# EAGLE design opnic (EAGLE 9.6.2)
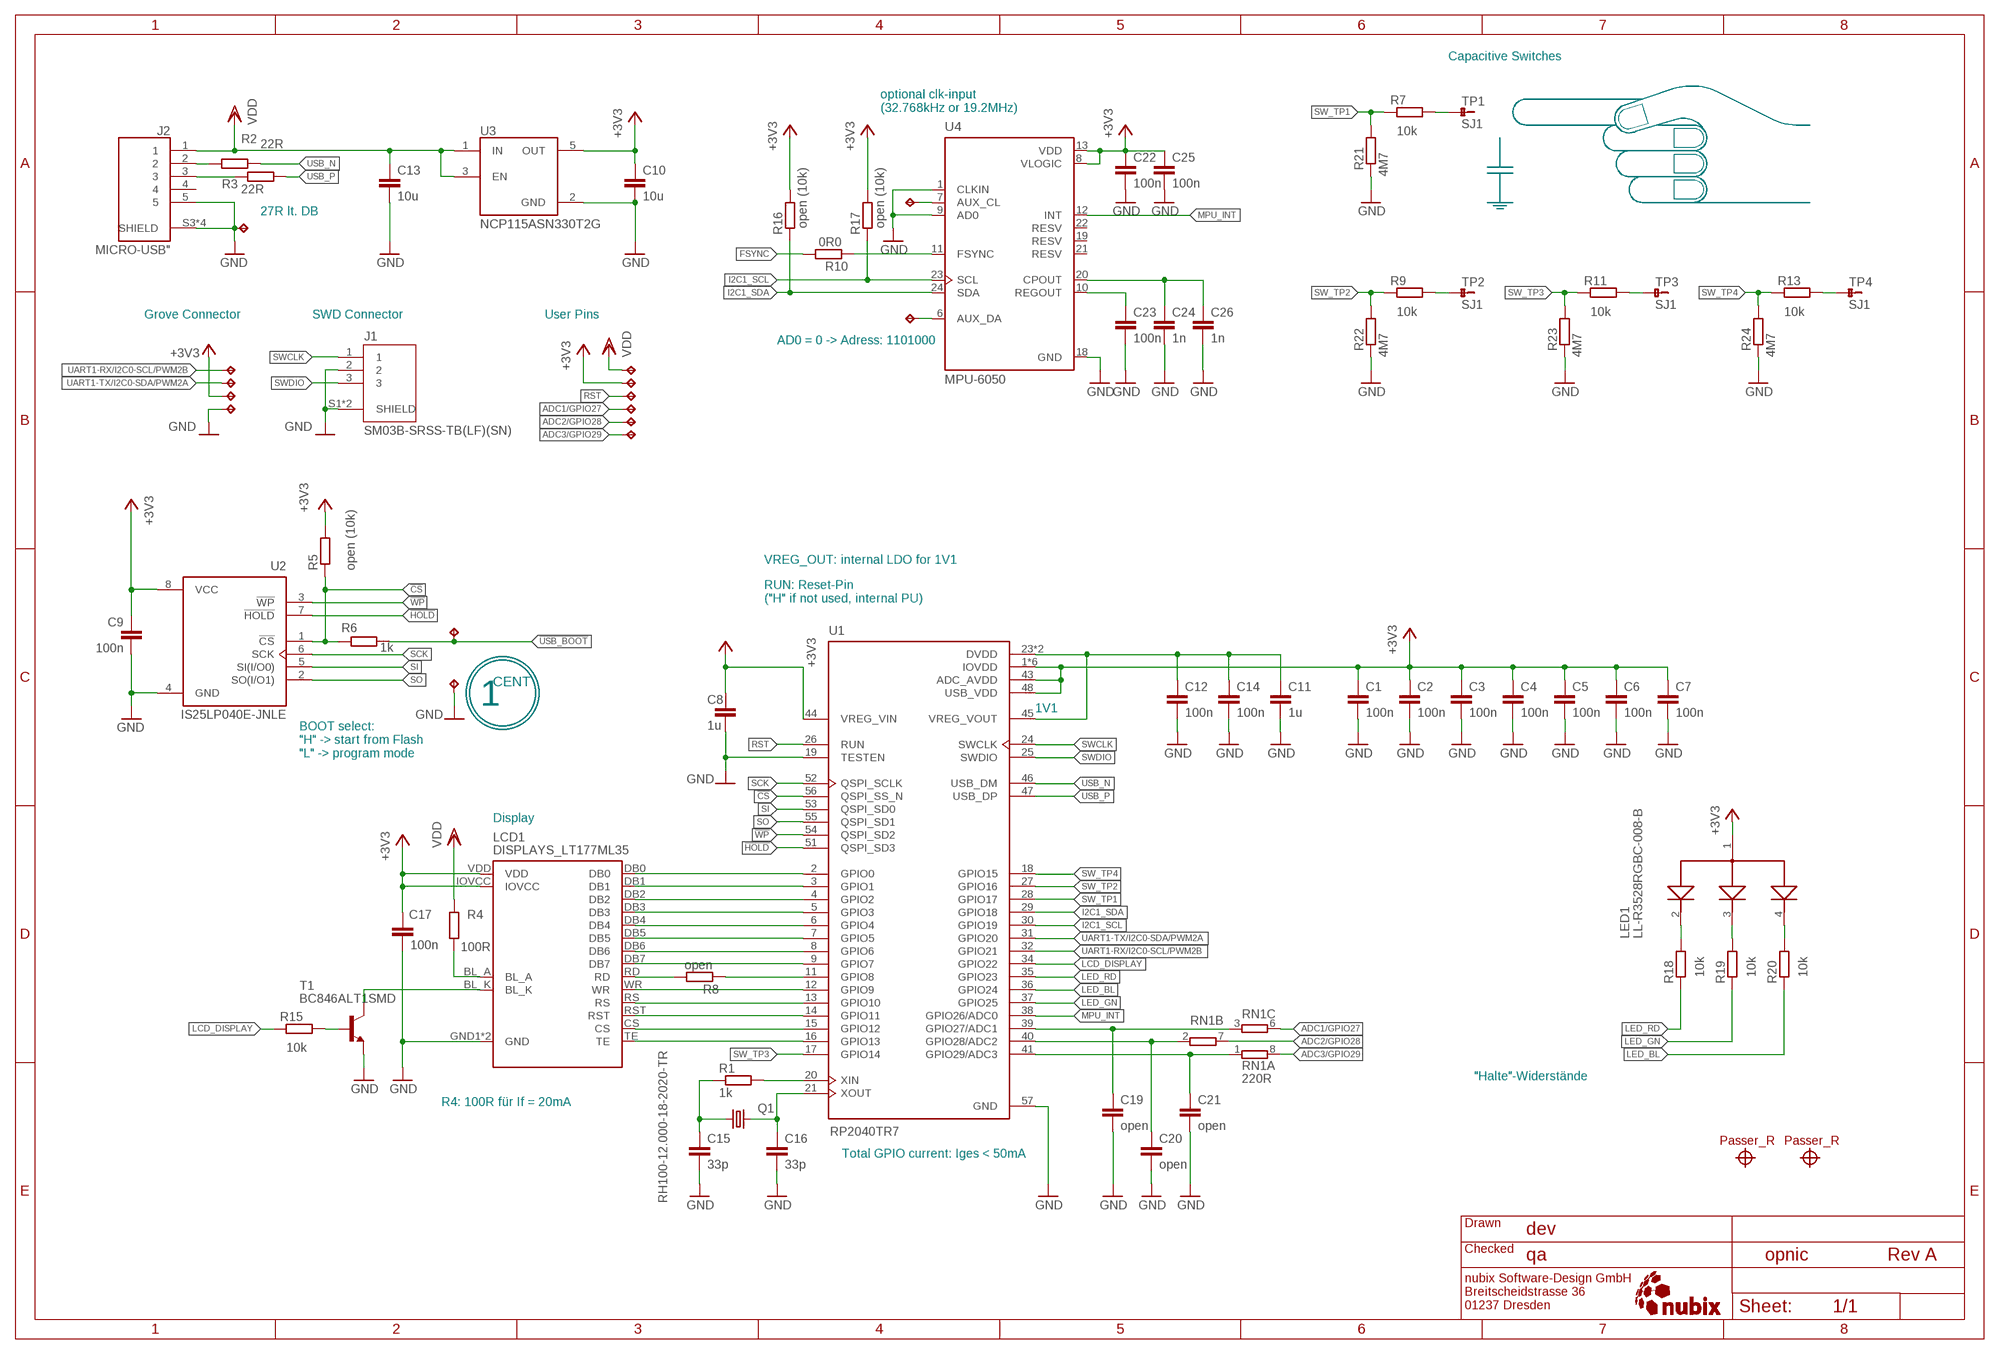
[diagram p0: schematic, sheet 1]
FRAME1 (A3L-LOC): NAME_CHECK: qa; NAME_DRAW: dev

## Parts
3V3  TPTP06SQ  [TP06SQ]
C1  100n  C-EUC0603  [C0603]
C2  100n  C-EUC0603  [C0603]
C3  100n  C-EUC0603  [C0603]
C4  100n  C-EUC0603  [C0603]
C5  100n  C-EUC0603  [C0603]
C6  100n  C-EUC0603  [C0603]
C7  100n  C-EUC0603  [C0603]
C8  1u  C-EUC0805  [C0805]
C9  100n  C-EUC0603  [C0603]
C10  10u  C-EUC1206  [C1206]
C11  1u  C-EUC0805  [C0805]
C12  100n  C-EUC0603  [C0603]
C13  10u  C-EUC1206  [C1206]
C14  100n  C-EUC0603  [C0603]
C15  33p  C-EUC0603  [C0603]
C16  33p  C-EUC0603  [C0603]
C17  100n  C-EUC0603  [C0603]
C19  open  C-EUC0603  [C0603]
C20  open  C-EUC0603  [C0603]
C21  open  C-EUC0603  [C0603]
C22  100n  C-EUC0603  [C0603]
C23  100n  C-EUC0603  [C0603]
C24  1n  C-EUC0603  [C0603]
C25  100n  C-EUC0603  [C0603]
C26  1n  C-EUC0603  [C0603]
CL  TPTP15SQ  [TP15SQ]
DA  TPTP15SQ  [TP15SQ]
GND  TPTP06SQ  [TP06SQ]
J1  SM03B-SRSS-TB(LF)(SN)  [JST_SM03B-SRSS-TB(LF)(SN)]
J2  MICRO-USB"  [MICRO-USB_MIDMOUNT]
LCD1  DISPLAYS_LT177ML35  [DISPLAYS_LT177ML35]
LED1  LL-R3528RGBC-008-B  [LED_LL-R3528RGBC-008-B]
P27  TPTP06SQ  [TP06SQ]
P28  TPTP06SQ  [TP06SQ]
P29  TPTP06SQ  [TP06SQ]
Q1  RH100-12.000-18-2020-TR  KX-7  [3.2X2.5_KX-7]
R1  1k  R-EU_R0603  [R0603]
R2  22R  R-EU_R0603  [R0603]
R3  22R  R-EU_R0603  [R0603]
R4  100R  R-EU_R0603  [R0603]
R5  open (10k)  R-EU_R0603  [R0603]
R6  1k  R-EU_R0603  [R0603]
R7  10k  R-EU_R0603  [R0603]
R8  open  R-EU_R0603  [R0603]
R9  10k  R-EU_R0603  [R0603]
R10  0R0  R-EU_R0603  [R0603]
R11  10k  R-EU_R0603  [R0603]
R13  10k  R-EU_R0603  [R0603]
R15  10k  R-EU_R0603  [R0603]
R16  open (10k)  R-EU_R0603  [R0603]
R17  open (10k)  R-EU_R0603  [R0603]
R18  10k  R-EU_R0603  [R0603]
R19  10k  R-EU_R0603  [R0603]
R20  10k  R-EU_R0603  [R0603]
R21  4M7  R-EU_R1206  [R1206]
R22  4M7  R-EU_R1206  [R1206]
R23  4M7  R-EU_R1206  [R1206]
R24  4M7  R-EU_R1206  [R1206]
RN1  220R  4R-N0603-ARC  [0603-ARC]
RST  TPTP06SQ  [TP06SQ]
SCL  TPTP06SQ  [TP06SQ]
SDA  TPTP06SQ  [TP06SQ]
T1  BC846ALT1SMD  [SOT23]
TP1  SJ1  [PAD1X1]
TP2  SJ1  [PAD1X1]
TP3  SJ1  [PAD1X1]
TP4  SJ1  [PAD1X1]
TP9  TPPAD1-17  [P1-17]
TP10  TPPAD1-17  [P1-17]
TP11  TPTP06SQ  [TP06SQ]
U1  RP2040TR7  [QFN40P700X700X90-57N]
U2  IS25LP040E-JNLE  AT25SF041B-SSHB-B  [SOIC127P599X175-8N]
U3  NCP115ASN330T2G  LD39015M12R  [SOT95P280X145-5N]
U4  MPU-6050  [QFN50P400X400X95-24N]
U$1  PASSER_R  [PASSER_RUND]
U$2  PASSER_R  [PASSER_RUND]
VCC1  TPTP06SQ  [TP06SQ]
VCC2  TPTP06SQ  [TP06SQ]

## Nets
!CS: R5.1 R6.2 U1.56(QSPI_SS_N) U2.1(!CS)
!HOLD: U1.51(QSPI_SD3) U2.7(!HOLD)
!USB_BOOT: R6.1 TP9.TP
!WP: U1.54(QSPI_SD2) U2.3(!WP)
+3V3: 3V3.TP C1.1 C2.1 C3.1 C4.1 C5.1 C6.1 C7.1 C8.1 C9.1 C10.1 C17.1 C22.1 C25.1 LCD1.IOVCC LCD1.VDD LED1.1(COMM_ANODE) R5.2 R16.2 R17.2 U1.1(IOVDD) U1.10(IOVDD) U1.22(IOVDD) U1.33(IOVDD) U1.42(IOVDD) U1.43(ADC_AVDD) U1.44(VREG_VIN) U1.48(USB_VDD) U1.49(IOVDD) U2.8(VCC) U3.5(OUT) U4.8(VLOGIC) U4.13(VDD) VCC1.TP
ADC1/GPIO27: P27.TP RN1.6
ADC2/GPIO28: P28.TP RN1.7
ADC3/GPIO29: P29.TP RN1.8
AUX_CL: CL.TP U4.7(AUX_CL)
AUX_DA: DA.TP U4.6(AUX_DA)
BL: LED1.4(CATHODE_BLUE) R20.2
BL_A: LCD1.BL_A R4.1
BL_K: LCD1.BL_K T1.3(C)
CPOUT: C24.1 C26.1 U4.20(CPOUT)
CS: LCD1.CS U1.15(GPIO12)
DB0: LCD1.DB0 U1.2(GPIO0)
DB1: LCD1.DB1 U1.3(GPIO1)
DB2: LCD1.DB2 U1.4(GPIO2)
DB3: LCD1.DB3 U1.5(GPIO3)
DB4: LCD1.DB4 U1.6(GPIO4)
DB5: LCD1.DB5 U1.7(GPIO5)
DB6: LCD1.DB6 U1.8(GPIO6)
DB7: LCD1.DB7 U1.9(GPIO7)
DM [USB]: J2.2 R2.1
DP [USB]: J2.3 R3.1
DVDD: C11.1 C12.1 C14.1 U1.23(DVDD) U1.45(VREG_VOUT) U1.50(DVDD)
FSYNC: R8.1 R10.2 U1.11(GPIO8)
GN: LED1.3(CATHODE_GREEN) R19.2
GND: C1.2 C2.2 C3.2 C4.2 C5.2 C6.2 C7.2 C8.2 C9.2 C10.2 C11.2 C12.2 C13.2 C14.2 C15.2 C16.2 C17.2 C19.2 C20.2 C21.2 C22.2 C23.2 C24.2 C25.2 C26.2 GND.TP J1.2 J1.S1(SHIELD) J1.S2(SHIELD) J2.5 J2.S3(SHIELD) J2.S4(SHIELD) J2.S5(SHIELD) J2.S6(SHIELD) LCD1.GND1(GND) LCD1.GND2(GND) R21.1 R22.1 R23.1 R24.1 T1.2(E) TP10.TP TP11.TP U1.19(TESTEN) U1.57(GND) U2.4(GND) U3.2(GND) U4.1(CLKIN) U4.9(AD0) U4.18(GND)
GPIO27: C19.1 RN1.3 U1.39(GPIO27/ADC1)
GPIO28: C20.1 RN1.2 U1.40(GPIO28/ADC2)
GPIO29: C21.1 RN1.1 U1.41(GPIO29/ADC3)
I2C1_SCL: R17.1 U1.30(GPIO19) U4.23(SCL)
I2C1_SDA: R16.1 U1.29(GPIO18) U4.24(SDA)
LCD_DISPLAY: R15.1 U1.34(GPIO22)
LED_BL: R20.1 U1.36(GPIO24)
LED_GN: R19.1 U1.37(GPIO25)
LED_RD: R18.1 U1.35(GPIO23)
MPU_FSYNC: R10.1 U4.11(FSYNC)
MPU_INT: U1.38(GPIO26/ADC0) U4.12(INT)
N$1: C15.1 Q1.1 R1.1
N$2: C16.1 Q1.3 U1.21(XOUT)
N$3: LCD1.RD R8.2
N$4: R1.2 U1.20(XIN)
N$27: R15.2 T1.1(B)
RED: LED1.2(CATHODE_RED) R18.2
REGOUT: C23.1 U4.10(REGOUT)
RS: LCD1.RS U1.13(GPIO10)
RST: RST.TP U1.26(RUN)
RST_DISPLAY: LCD1.RST U1.14(GPIO11)
SCK: U1.52(QSPI_SCLK) U2.6(SCK)
SI: U1.53(QSPI_SD0) U2.5(SI(I/O0))
SO: U1.55(QSPI_SD1) U2.2(SO(I/O1))
SW_TP1: R7.1 R21.2 U1.28(GPIO17)
SW_TP2: R9.1 R22.2 U1.27(GPIO16)
SW_TP3: R11.1 R23.2 U1.17(GPIO14)
SW_TP4: R13.1 R24.2 U1.18(GPIO15)
SWCLK: J1.1 U1.24(SWCLK)
SWDIO: J1.3 U1.25(SWDIO)
TE: LCD1.TE U1.16(GPIO13)
TP1: R7.2 TP1.P$1
TP2: R9.2 TP2.P$1
TP3: R11.2 TP3.P$1
TP4: R13.2 TP4.P$1
UART1-RX/I2C0-SCL/PWM2B: SCL.TP U1.32(GPIO21)
UART1-TX/I2C0-SDA/PWM2A: SDA.TP U1.31(GPIO20)
USB_N [USB]: R2.2 U1.46(USB_DM)
USB_P [USB]: R3.2 U1.47(USB_DP)
VDD: C13.1 J2.1 R4.2 U3.1(IN) U3.3(EN) VCC2.TP
WR: LCD1.WR U1.12(GPIO9)
Unconnected: J2.4 RN1.4 RN1.5 U4.19(RESV) U4.21(RESV) U4.22(RESV)

## Notes on the sheet
- Capacitive Switches
- optional clk-input
  (32.768kHz or 19.2MHz)
- 27R lt. DB
- Grove Connector | SWD Connector | User Pins
- AD0 = 0 -> Adress: 1101000
- VREG_OUT: internal LDO for 1V1
- RUN: Reset-Pin
  ("H" if not used, internal PU)
- CENT
- 1
- 1V1
- BOOT select:
  "H" -> start from Flash
  "L" -> program mode
- Display
- "Halte"-Widerstände
- R4: 100R für If = 20mA
- Total GPIO current: Iges < 50mA
- Rev A

## Library data of the parts
3V3 CL DA GND P27-P29 RST SCL SDA TP9-TP11 VCC1 VCC2 = testpad:TP: Test pad
C1-C17 C19-C26 = rcl:C-EU: CAPACITOR, European symbol; SPICEPREFIX: C
J1 = SM03B-SRSS-TB_LF__SN_:SM03B-SRSS-TB(LF)(SN): SH Series 3 Position 1 mm Pitch Surface Mount Side Entry Shrouded Header Check availability <https://pricing.snapeda.com/parts/SM03B-SRSS-TB%28LF%29%28SN%29/JST%20Sales/view-part?ref=eda>; AVAILABILITY: In Stock; DESCRIPTION: Connector Header Surface Mount, Right Angle 3 position 0.039 (1.00mm); MF: JST Sales; MP: SM03B-SRSS-TB(LF)(SN); PACKAGE: None; PRICE: None; PURCHASE-URL: https://pricing.snapeda.com/search/part/SM03B-SRSS-TB(LF)(SN)/?ref=eda
J2 = MicroUSB:MICRO-USB
LCD1 = displays:DISPLAYS_LT177ML35
LED1 = LL-R3528RGBC-008-B:LL-R3528RGBC-008-B: LED; SMD; 3528, PLCC2; RGB; 3.5x2.8mm; 120°; Red lumin: 1 Check availability <https://pricing.snapeda.com/parts/LL-R3528RGBC-008-B/Lucky%20Light/view-part?ref=eda>; AVAILABILITY: Not in stock; DESCRIPTION: LED; SMD; 3528, PLCC2; RGB; 3.5x2.8mm; 120°; Red lumin: 1; MF: Lucky Light; MP: LL-R3528RGBC-008-B; PACKAGE: PLCC-2 Lucky Light; PRICE: None
Q1 = crystal-geyer_V1_0:KX: Quartz Crystals (MHz) SMD: KX - Serie Model Size l/w/h [mm] Frequency Range Frequency Stability Temp. Range [°C] Load Capacitance AECQ 200 availabel Datasheet KX-4 KX-5 KX-6 KX-7 KX-9A KX-9B KX-12A KX-12B KX-13 KX-20 KX-K KX-KS 1.6/1.2/0.3 2.0/1.6/0.45 2.5/2.0/0.55 3.2/2.5/0.8 5.0/3.2/1.0 5.0/3.2/1.1 6.0/3.5/1.1 6.0/3.5/1.0 7.0/5.0 /1.3 11.6/5.5/1.6 12.3/4.5/4.2 12.3/4.5/3.2 24.0 ~ 80.0 MHz 16.0 ~ 80.0 MHz 12.0 ~ 80.0 MHz 8.0 ~ 60.0 MHz 7,68 ~ 300,0 MHz 8,0 ~ 50,0 MHz 8,0 ~ 150,0 MHz 8,0 ~ 50,0 MHz 6,0 ~ 160,0 MHz 3,579 ~ 25,0 MHz 3,579 ~ 70,0 MHz 3,579 ~ 70,0 MHz ±10 … ±50ppm ±10 … ±50ppm ±10 … ±50ppm ±10 … ±50ppm ±10 … ±50ppm ±10 … ±50ppm ±10 … ±50ppm ±10 … ±50ppm ±10 … ±50ppm ±50ppm ±10 … ±50ppm ±10 … ±50ppm (*) -40°C …+85°C (*) -40°C …+125°C (*) -40°C …+125°C (*) -40°C …+125°C (*) -40°C …+105°C (*) -40°C …+105°C (*) -40°C …+125°C (*) -40°C …+105°C (*) -40°C …+105°C (*) -40°C …+105°C (*) -40°C …+85°C (*) -40°C …+85°C 8, 8…16 8, 8…16 10, 8…16 12, 7…20 16, 10…20 16, 10…20 16, 10…20 16, 12…20 16, 12…20 16, 12…20 16, 12…30 16, 12…30 - yes yes yes - - - - - - - - KX-4.pdf <http://www.geyer-electronic.de/uploads/tx_userartikelfrequenz/GEYER-KX-4.pdf> KX-5.pdf <http://www.geyer-electronic.de/uploads/tx_userartikelfrequenz/GEYER-KX-5.pdf> KX-6.pdf <http://www.geyer-electronic.de/uploads/tx_userartikelfrequenz/GEYER-KX-6.pdf> KX-7.pdf <http://www.geyer-electronic.de/uploads/tx_userartikelfrequenz/GEYER-KX-7.pdf> KX-9A.pdf <http://www.geyer-electronic.de/uploads/tx_userartikelfrequenz/GEYER-KX-9A.pdf> KX-9B.pdf <http://www.geyer-electronic.de/uploads/tx_userartikelfrequenz/GEYER-KX-9B.pdf> KX-12A.pdf <http://www.geyer-electronic.de/uploads/tx_userartikelfrequenz/GEYER-KX-12A.pdf> KX-12B.pdf <http://www.geyer-electronic.de/uploads/tx_userartikelfrequenz/GEYER-KX-12B.pdf> KX-13.pdf <http://www.geyer-electronic.de/uploads/tx_userartikelfrequenz/GEYER-KX-13.pdf> KX-20.pdf <http://www.geyer-electronic.de/uploads/tx_userartikelfrequenz/GEYER-KX-20.pdf> KX-K.pdf <http://www.geyer-electronic.de/uploads/tx_userartikelfrequenz/GEYER-KX-K.pdf> KX-KS.pdf <http://www.geyer-electronic.de/uploads/tx_userartikelfrequenz/GEYER-KX-KS.pdf> <http://www.geyer-electronic.de/fileadmin/template/img/logo-geyer-electronic.png> Details see: http://www.geyer-electronic.de/Frequenz-Produkte.9.0.html Created 2016-06-07, Hans Locher 2016 (C) Geyer Quartz Technology KX4,KX5,KX6,KX7,KX9A,KX9B,KX12A,KX12B,KX13,KX20,KXK,KXKS;1612;2016;2520;3225;5032;6035;7050;11655;12345;1,6x1,2;2,0x1,6;2,5x2,0;3,2x2,5;5,0x3,2;6,0x3,5;7,0x5,0;11,6x5,5;12,3x4,5;12,3x4,5;1.6x1.2;2.0x1.6;2.5x2.0;3.2x2.5;5.0x3.2;6.0x3.5;7.0x5.0;11.6x5.5;12.3x4.5;12.3x4.5;
R1-R11 R13 R15-R24 = rcl:R-EU_: RESISTOR, European symbol; SPICEPREFIX: R
RN1 = resistor-dil:4R-N: Array Chip Resistor Source: RS Component / Phycomp; OC_FARNELL: unknown; OC_NEWARK: unknown
T1 = transistor-npn:BC846*: NPN Transistor
TP1-TP4 = jumper:SJ1
U1 = RP2040TR7:RP2040TR7: Check availability <https://pricing.snapeda.com/parts/RP2040TR7/Raspberry%20Pi/view-part?ref=eda>; AVAILABILITY: In Stock; DESCRIPTION: MCU, 32BIT, 133MHZ, QFN-56; Product Range:-; Architecture:ARM Cortex-M0+; No. of Bits:32bit; CPU Speed:133MHz; Program Memory Size:16MB; RAM Memory Size:264KB; No. of Pins:56Pins; MCU Case Style:QFN; No. of I/O s:30I/O s; MF: Raspberry Pi; MP: RP2040TR7; PACKAGE: None; PRICE: None
U2 = AT25SF041B-SSHB-B:AT25SF041B-SSHB-B: Flash Serial-SPI 2.5V/3.3V 1Mbit 1M x 1bit 6ns 8-Pin SOIC N Tube Check availability <https://pricing.snapeda.com/parts/AT25SF041B-SSHB-B/Adesto%20Technologies/view-part?ref=eda>; AVAILABILITY: In Stock; DESCRIPTION: 4 Mbit, 3.0V (2.7V to 3.6V), -40C to 85C, SOIC-N 150mil (Tube), Single, Dual, Quad SPI NOR flash; MF: Adesto Technologies; MP: AT25SF041B-SSHB-B; PACKAGE: SOIC-8 Dialog Semiconductor; PRICE: None; PURCHASE-URL: https://pricing.snapeda.com/search/part/AT25SF041B-SSHB-B/?ref=eda
U3 = LD39015M12R:LD39015M12R: LD39015 Series 150 mA 1.2 V Fixed Low Noise LDO Voltage Regulator - SOT-23-5 Check availability <https://pricing.snapeda.com/parts/LD39015M12R/STMicroelectronics/view-part?ref=eda>; AVAILABILITY: In Stock; DESCRIPTION: Linear Voltage Regulator IC Positive Fixed 1 Output 150mA SOT-23-5; MF: STMicroelectronics; MP: LD39015M12R; PACKAGE: SOT-23-5 STMicroelectronics; PRICE: None; PURCHASE-URL: https://pricing.snapeda.com/search/part/LD39015M12R/?ref=eda
U4 = MPU-6050:MPU-6050: MPU-6050 Six-Axis (Gyro + Accelerometer) MEMS MotionTracking™ Devices Check availability <https://pricing.snapeda.com/parts/MPU-6050/TDK%20InvenSense/view-part?ref=eda>; AVAILABILITY: In Stock; DESCRIPTION: MPU-6050 series Accelerometer, Gyroscope, 3 Axis Sensor Evaluation Board; MF: TDK InvenSense; MP: MPU-6050; PACKAGE: QFN-24 InvenSense; PRICE: None; PURCHASE-URL: https://pricing.snapeda.com/search/part/MPU-6050/?ref=eda
U$1 U$2 = Misc:PASSER_R

## Net classes
0 default: width 0.2 mm, drill 0.2 mm, clearance 0.1 mm
1 USB: width 0.2 mm, drill 0.2 mm, clearance 0.127 mm to class 0, clearance 0.127 mm

## Board
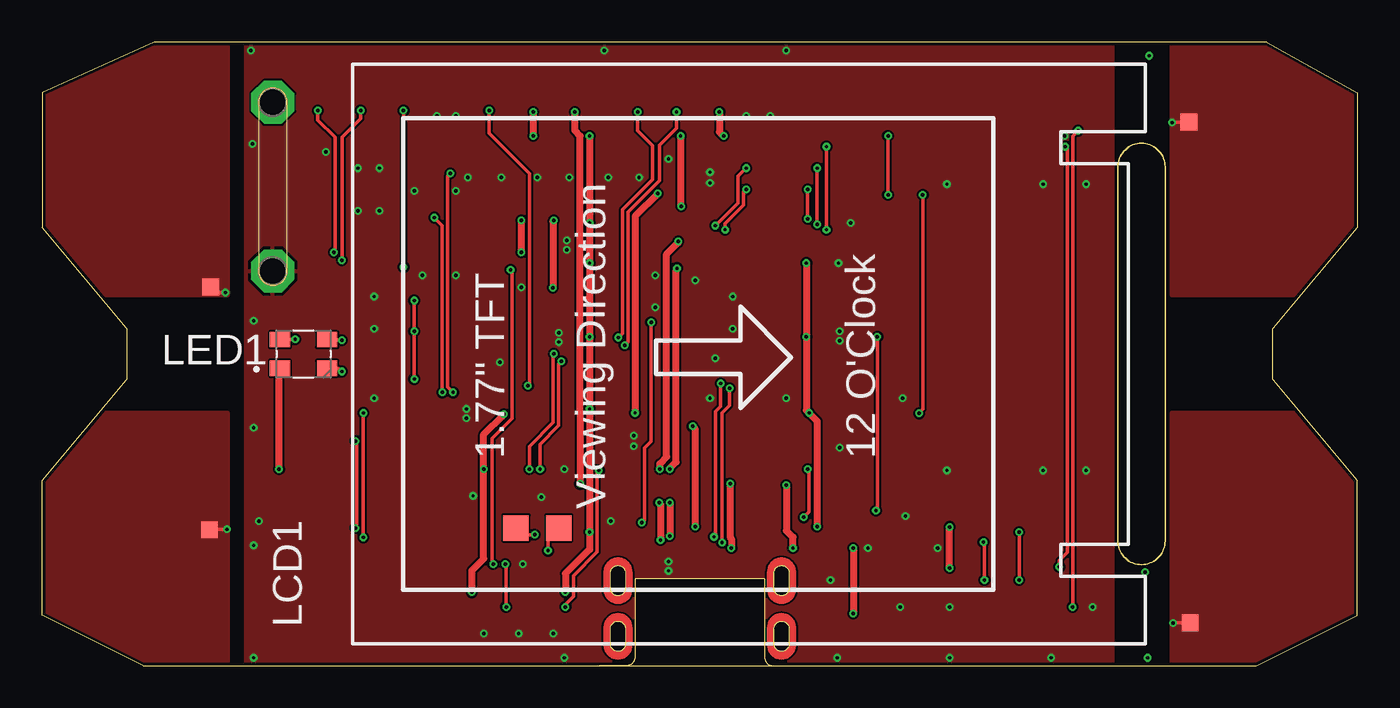
[diagram p1: board, top side]
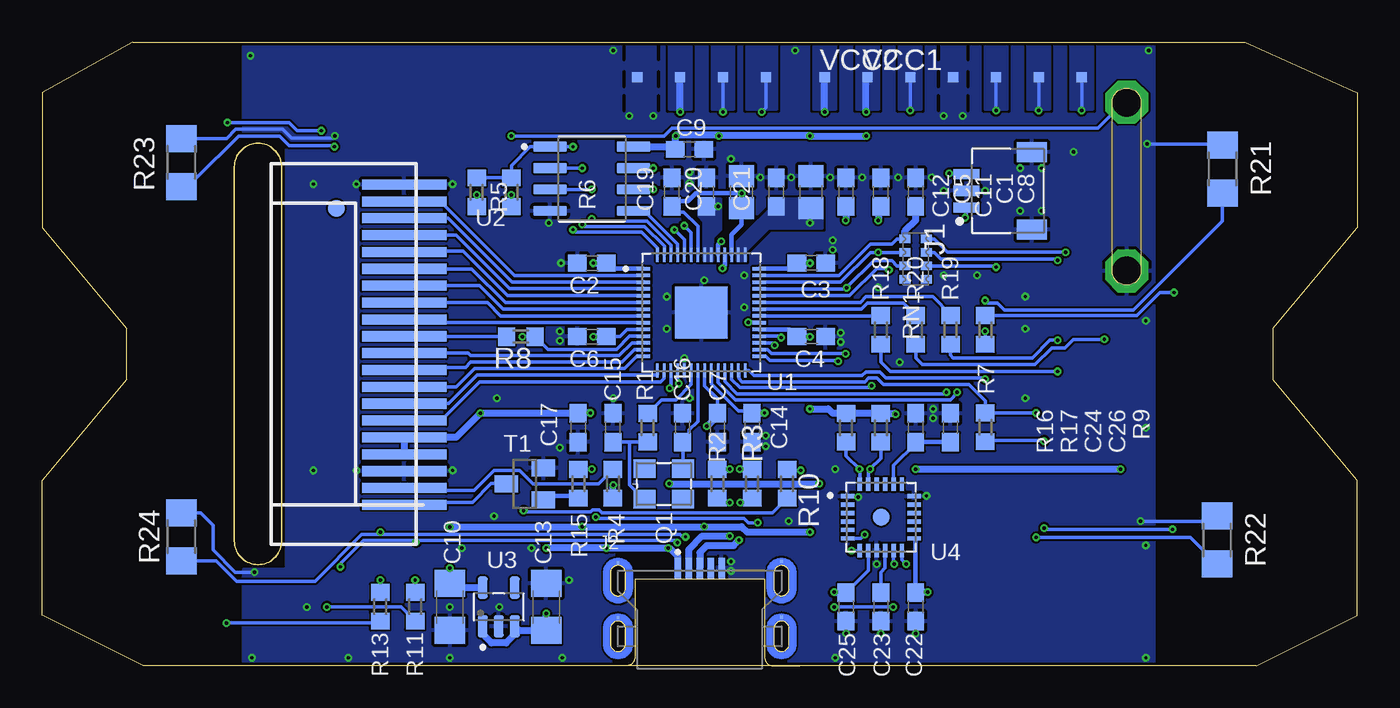
[diagram p2: board, bottom side, seen from below]

Size 78 x 37 mm. Coordinates in mm from the lower left corner, seen from the top.
Outline: 6,0 72,0 78,3 78,11 73,17 73,20 78,26 78,34 72.64,37 6.63,37 0,34 0,26 5,20 5,17 0,11 0,3 6,0
Copper layers (1*16): Top 0.018mm / dielectric 1.55mm / Bottom 0.018mm
Design rules "Multi-CB_2L_125um-Tracks_OL35um *": minimum track width 0.125mm, minimum drill 0.2mm, track to track 0.125mm, track to pad 0.125mm, pad to pad 0.125mm, via to via 0.125mm, smd to smd 0mil, copper to edge 0.2mm, drill to drill 0.2mm, minimum pad ring 0.125mm, minimum via ring 0.125mm, stop-mask expansion 2mil, vias tented up to drill 0.45mm, thermal gap 0.2mm
tKeepout: area 0,0 to 12,37; area 13.5,21 to 15.2,37.5; area 66,0 to 78,37
tRestrict: area 35.2,0 to 42.9,5.2
bRestrict: area 35.2,0 to 42.9,5.2; 12 lines
Milling: 12 lines

### Footprints (pad centres in the part's own frame; a part is rotated, then mirrored left to right if it is on the bottom)
TP06SQ = smd 0.6 x 0.6: TP 0,0
C0603 = smd 1.1 x 1: 1 -0.85,0; 2 0.85,0
C0805 = smd 1.3 x 1.5: 1 -0.95,0; 2 0.95,0
C1206 = smd 1.6 x 1.8: 1 -1.4,0; 2 1.4,0
TP15SQ = smd 1.5 x 1.5: TP 0,0
JST_SM03B-SRSS-TB(LF)(SN) = smd 0.6 x 1.55: 1 -1,0; 2 0,0; 3 1,0 | smd 1.2 x 1.8: S1 -2.3,-3.875; S2 2.3,-3.875
MICRO-USB_MIDMOUNT = smd 0.4 x 1.2: 1 -1.3,5.8; 2 -0.65,5.8; 3 0,5.8; 4 0.65,5.8; 5 1.3,5.8 | smd 0.2 x 0.2: S3 -4.85,6.1; S4 4.85,6.2; S5 -4.85,2.85; S6 4.85,2.9
DISPLAYS_LT177ML35 = smd 0.6 x 5 bottom: BL_A 9.25,8.895; BL_K 8.25,8.895; CS 14.25,8.895; DB0 26.25,8.895; DB1 25.25,8.895; DB2 24.25,8.895; DB3 23.25,8.895; DB4 22.25,8.895; DB5 21.25,8.895; DB6 20.25,8.895; DB7 19.25,8.895; GND1 10.25,8.895; GND2 27.25,8.895; IOVCC 12.25,8.895; RD 18.25,8.895; RS 16.25,8.895; RST 15.25,8.895; TE 13.25,8.895; VDD 11.25,8.895; WR 17.25,8.895
LED_LL-R3528RGBC-008-B = smd 1.2 x 0.9: 1 -1.4,-0.85; 2 1.4,-0.85; 3 1.4,0.85; 4 -1.4,0.85
3.2X2.5_KX-7 = smd 1.3 x 1.1: 1 -1.15,-0.9; 2 1.15,-0.9; 3 1.15,0.9; 4 -1.15,0.9
R0603 = smd 1 x 1.1: 1 -0.85,0; 2 0.85,0
R1206 = smd 1.6 x 1.803: 1 -1.422,0; 2 1.422,0
0603-ARC = smd 0.5 x 0.65: 1 -1.2,-0.625; 2 -0.4,-0.625; 3 0.4,-0.625; 4 1.2,-0.625; 5 1.2,0.625; 6 0.4,0.625; 7 -0.4,0.625; 8 -1.2,0.625
SOT23 = smd 1 x 1.4: 1 -0.95,-1.1; 2 0.95,-1.1; 3 0,1.1
PAD1X1 = smd 1 x 1: P$1 0,0
P1-17 = drill 1.702 pad 2.54 octagon: TP 0,0
QFN40P700X700X90-57N = smd 0.84 x 0.2: 1 -3.435,2.6; 2 -3.435,2.2; 3 -3.435,1.8; 4 -3.435,1.4; 5 -3.435,1; 6 -3.435,0.6; 7 -3.435,0.2; 8 -3.435,-0.2; 9 -3.435,-0.6; 10 -3.435,-1; 11 -3.435,-1.4; 12 -3.435,-1.8; 13 -3.435,-2.2; 14 -3.435,-2.6; 29 3.435,-2.6; 30 3.435,-2.2; 31 3.435,-1.8; 32 3.435,-1.4; 33 3.435,-1; 34 3.435,-0.6; 35 3.435,-0.2; 36 3.435,0.2; 37 3.435,0.6; 38 3.435,1; 39 3.435,1.4; 40 3.435,1.8; 41 3.435,2.2; 42 3.435,2.6 | smd 0.2 x 0.84: 15 -2.6,-3.435; 16 -2.2,-3.435; 17 -1.8,-3.435; 18 -1.4,-3.435; 19 -1,-3.435; 20 -0.6,-3.435; 21 -0.2,-3.435; 22 0.2,-3.435; 23 0.6,-3.435; 24 1,-3.435; 25 1.4,-3.435; 26 1.8,-3.435; 27 2.2,-3.435; 28 2.6,-3.435; 43 2.6,3.435; 44 2.2,3.435; 45 1.8,3.435; 46 1.4,3.435; 47 1,3.435; 48 0.6,3.435; 49 0.2,3.435; 50 -0.2,3.435; 51 -0.6,3.435; 52 -1,3.435; 53 -1.4,3.435; 54 -1.8,3.435; 55 -2.2,3.435; 56 -2.6,3.435 | smd 3.1 x 3.1: 57 0,0
SOIC127P599X175-8N = smd 1.97 x 0.6: 1 -2.47,1.905; 2 -2.47,0.635; 3 -2.47,-0.635; 4 -2.47,-1.905; 5 2.47,-1.905; 6 2.47,-0.635; 7 2.47,0.635; 8 2.47,1.905
SOT95P280X145-5N = smd 1.32 x 0.59: 1 -1.145,0.95; 2 -1.145,0; 3 -1.145,-0.95; 4 1.145,-0.95; 5 1.145,0.95
QFN50P400X400X95-24N = smd 0.79 x 0.26: 1 -1.97,1.25; 2 -1.97,0.75; 3 -1.97,0.25; 4 -1.97,-0.25; 5 -1.97,-0.75; 6 -1.97,-1.25; 13 1.97,-1.25; 14 1.97,-0.75; 15 1.97,-0.25; 16 1.97,0.25; 17 1.97,0.75; 18 1.97,1.25 | smd 0.26 x 0.79: 7 -1.25,-1.97; 8 -0.75,-1.97; 9 -0.25,-1.97; 10 0.25,-1.97; 11 0.75,-1.97; 12 1.25,-1.97; 19 1.25,1.97; 20 0.75,1.97; 21 0.25,1.97; 22 -0.25,1.97; 23 -0.75,1.97; 24 -1.25,1.97
PASSER_RUND = smd 1 x 1: P$1 0,0

### Placement (x,y rotation side)
3V3  40.16,34.92 0 bottom
C1  34.46,28.1 90 bottom
C2  45.4,23.89 180 bottom
C3  32.38,23.89 0 bottom
C4  32.38,19.53 0 bottom
C5  38.59,28.1 90 bottom
C6  45.4,19.53 180 bottom
C7  37.96,14.13 270 bottom
C8  32.4,28.1 90 bottom
C9  39.61,30.64 0 bottom
C10  53.82,3.49 270 bottom
C11  36.53,28.1 90 bottom
C12  40.66,28.1 90 bottom
C13  48.1,3.49 90 bottom
C14  35.89,14.13 270 bottom
C15  44.15,14.13 90 bottom
C16  40.02,14.13 90 bottom
C17  46.21,14.13 270 bottom
C19  30.32,28.1 90 bottom
C20  28.26,28.1 90 bottom
C21  26.19,28.1 90 bottom
C22  26.19,3.49 270 bottom
C23  28.26,3.49 270 bottom
C24  26.19,14.13 90 bottom
C25  30.32,3.49 270 bottom
C26  24.13,14.13 90 bottom
CL  30.64,8.18 0 top
DA  28.1,8.18 0 top
GND  42.7,34.92 0 bottom
J1  23.18,28.18 90 bottom
J2  39,0 0 bottom
LCD1  65.42,1.3 90 top
LED1  15.5,18.5 0 top
P27  21.43,34.92 90 bottom
P28  18.89,34.92 90 bottom
P29  16.35,34.92 90 bottom
Q1  41.13,10.79 0 bottom
R1  42.08,14.13 90 bottom
R2  37.96,10.79 90 bottom
R3  35.89,10.79 90 bottom
R4  44.15,10.79 270 bottom
R5  52.23,28.1 270 bottom
R6  50.16,28.1 90 bottom
R7  22.07,19.92 90 bottom
R8  49.61,19.53 180 bottom
R9  22.07,14.14 270 bottom
R10  33.81,10.79 270 bottom
R11  55.88,3.51 270 bottom
R13  57.94,3.51 270 bottom
R15  46.2,10.79 270 bottom
R16  30.32,14.13 90 bottom
R17  28.26,14.13 90 bottom
R18  28.26,19.92 270 bottom
R19  24.13,19.92 270 bottom
R20  26.19,19.92 270 bottom
R21  8,29.48 270 bottom
R22  8.32,7.46 270 bottom
R23  69.73,29.86 270 bottom
R24  69.73,7.65 270 bottom
RN1  26.19,24.13 270 bottom
RST  26.51,34.92 0 bottom
SCL  35.08,34.92 0 bottom
SDA  37.62,34.92 0 bottom
T1  49.37,10.79 90 bottom
TP1  10,22.46 0 top
TP2  9.92,8.08 0 top
TP3  68,32.25 0 top
TP4  68.08,2.54 0 top
TP9  13.68,33.43 0 top
TP10  13.68,23.43 0 top
TP11  23.97,34.92 0 bottom
U1  38.91,20.95 0 bottom
U2  45.4,28.89 0 bottom
U3  50.93,3.49 90 bottom
U4  28.26,8.81 0 bottom
U$1  60.55,27.15 0 bottom
U$2  28.24,8.81 0 bottom
VCC1  29.05,34.92 0 bottom
VCC2  31.59,34.92 0 bottom

### Tracks (layer width: path | path; a pad name or v marks a point on that pad's centre or on a via)
!CS  (via drill 0.2)
  Top 0.2: v46.51,25.88 v46.51,30.8
  Bottom 0.2: U1.56 41.51,24.79 42.45,25.73 46.37,25.73 v46.51,25.88 | v46.51,30.8 U2.1 49.05,30.8 50.16,29.69 R6.2 R5.1
!HOLD  (via drill 0.2)
  Top 0.2: v41.75,29.53 41.27,29.05 41.27,27.46 v39.93,26.11
  Bottom 0.2: U2.7 v41.75,29.53 | v39.93,26.11 39.51,25.7 U1.51
!USB_BOOT  (via drill 0.2)
  Top 0.2: v50.16,31.43 v50.16,27.94
  Bottom 0.2: TP9.TP 13.88,33.43 15.4,31.91 40.64,31.91 41.12,31.43 v50.16,31.43 | R6.1 v50.16,27.94
!WP  (via drill 0.2)
  Top 0.2: v45.4,26.51 v45.4,28.26
  Bottom 0.2: U1.54 40.71,24.95 42.13,26.38 45.27,26.38 v45.4,26.51 | v45.4,28.26 U2.3
+3V3  (via drill 0.2)
  Top 0.2: v52.23,27.94 52.23,15.24 52.01,15.03 v52.01,14.98
  Top 0.406: v45.32,23.89 v45.32,19.53 45.32,15.16 v45.48,15 45.96,14.53 v45.96,8.26 | v53.82,5.79 v53.82,8.24 | v38.73,8.26 38.73,14.05 v38.58,14.21 | v31.04,4.37 31.04,5.48 32.46,6.91 v32.46,7.94 v32.46,15.24 v32.46,19.53 v32.46,23.89 v32.46,26.27 v32.46,31.43 | v37.86,31.45 37.86,31.43 37.9,31.39 v37.9,27.27 | v25.48,4.37 25.48,5.64 26.19,6.35 v26.19,11.67 26.19,13.73 v27.38,14.92 | v40.16,32.86 40.16,31.67 40.4,31.43 40.41,31.43 v40.42,31.45 | v29.13,31.43 v29.13,32.86 | v14.05,11.67 14.02,11.7 14.02,17.57 LED1.1
  Bottom 0.2: U1.10 43.31,19.95 43.74,19.53 C6.1 | C25.1 30.24,4.42 30.24,4.43 29.01,5.67 U4.8 | U1.22 38.71,16.6 37.96,15.85 C7.1 | R5.2 v52.23,27.94
  Bottom 0.254: U1.1 44.22,23.55 C2.1 | U1.42 33.57,23.55 C3.1 | U4.13 26.21,7.48 26.21,4.36 C22.1 | C4.1 33.66,19.95 U1.33
  Bottom 0.406: v45.32,19.53 C6.1 | v45.32,23.89 C2.1 | v45.48,15 46.19,15 C17.1 v52.01,14.98 53.44,13.55 LCD1.IOVCC LCD1.VDD | C3.1 v32.46,23.89 | U3.5 53.56,4.64 C10.1 v53.82,5.79 | v53.82,8.24 53.8,8.26 v45.96,8.26 v38.73,8.26 36.51,8.26 36.2,7.94 v32.46,7.94 | v38.58,14.21 37.96,14.83 C7.1 | v32.46,15.24 31.38,15.24 31.11,14.98 R16.2 R17.2 27.44,14.98 v27.38,14.92 | v31.04,4.37 30.34,4.37 C25.1 | C5.1 37.92,27.25 v37.9,27.27 | 37.84,31.47 40.42,31.47 40.46,31.43 C9.1 | 37.84,31.47 32.5,31.47 v32.46,31.43 v29.13,31.43 | v37.86,31.45 37.84,31.47 | v25.48,4.37 26.22,4.37 26.21,4.36 | v40.16,32.86 3V3.TP | U2.8 40.62,30.8 C9.1 | v40.42,31.45 40.46,31.41 C9.1 | C4.1 v32.46,19.53 | v29.13,32.86 29.13,34.85 VCC1.TP | v26.19,11.67 v14.05,11.67
  pour Bottom (no thermals): 39.53,36.83 40.8,36.83 40.8,33.02 39.53,33.02
  pour Bottom (no thermals): 38.73,24.05 38.73,26.35 39.05,26.67 39.05,27.7 37.78,27.7 37.78,25.88 38.26,25.4 38.26,24.05
  pour Bottom (no thermals): 31.75,27.7 34.21,27.7 36.75,25.16 36.75,24.05 36.27,24.05 36.27,24.61 34.92,25.96 31.75,25.96
  pour Bottom (no thermals): 28.42,36.83 29.69,36.83 29.69,33.02 28.42,33.02
ADC1/GPIO27  (via drill 0.2)
  Top 0.2: v21.43,32.94 v21.43,23.65
  Bottom 0.2: RN1.6 21.51,23.73 v21.43,23.65 | P27.TP v21.43,32.94
  pour Bottom (no thermals): 20.8,36.83 22.07,36.83 22.07,33.02 20.8,33.02
ADC2/GPIO28  (via drill 0.2)
  Top 0.2: v18.89,32.94 18.89,32.46 17.78,31.35 v17.78,24.05
  Bottom 0.2: RN1.7 25.09,24.53 24.7,24.13 17.86,24.13 v17.78,24.05 | v18.89,32.94 P28.TP
  pour Bottom (no thermals): 18.26,36.83 19.53,36.83 19.53,33.02 18.26,33.02
ADC3/GPIO29  (via drill 0.2)
  Top 0.2: v16.35,32.94 16.35,32.38 17.38,31.35 17.38,24.61 v17.3,24.53
  Bottom 0.2: RN1.8 25.09,25.33 24.3,24.54 17.31,24.54 v17.3,24.53 | v16.35,32.94 P29.TP
  pour Bottom (no thermals): 15.72,36.83 16.99,36.83 16.99,33.02 15.72,33.02
AUX_CL  (via drill 0.2)
  Top 0.2: CL.TP 30,7.54 v30,6.83
  Bottom 0.2: U4.7 29.52,6.83 v30,6.83
AUX_DA  (via drill 0.2)
  Top 0.2: v29.21,7.78 28.5,7.78 DA.TP
  Bottom 0.2: U4.6 29.43,7.56 v29.21,7.78
BL  (via drill 0.2)
  Top 0.2: v15,19.37 14.98,19.35 LED1.4
  Bottom 0.2: R20.2 26.19,18.26 25.8,17.87 19.12,17.87 18.12,18.86 17.36,18.86 16.85,19.37 v15,19.37
BL_A
  Bottom 0.2: R4.1 45,10.79 48.9,10.79 49.68,11.58 51.21,11.58 52.4,10.39 56.37,10.39 LCD1.BL_A
BL_K
  Bottom 0.2: 50.5,10.82 51.37,10.82 52.48,9.71 56.37,9.71 LCD1.BL_K
  Bottom 0.254: 50.5,10.82 T1.3
CPOUT
  Bottom 0.2: U4.20 27.51,11.89 26.19,13.21 C24.1
  Bottom 0.254: C24.1 C26.1
CS
  Bottom 0.2: U1.15 41.51,17.28 41.53,17.26 52.2,17.26 53.9,15.55 LCD1.CS
DB0
  Bottom 0.2: U1.2 49.98,23.16 54.38,27.55 LCD1.DB0
DB1
  Bottom 0.2: 42.37,22.78 50.14,22.78 53.91,26.55 LCD1.DB1
  Bottom 0.254: U1.3 42.37,22.78
DB2
  Bottom 0.2: 42.37,22.38 50.28,22.38 53.45,25.55 LCD1.DB2
  Bottom 0.254: U1.4 42.37,22.38
DB3
  Bottom 0.2: U1.5 50.39,21.95 53.03,24.6 56.48,24.6 LCD1.DB3
DB4
  Bottom 0.2: U1.6 50.53,21.55 52.52,23.55 LCD1.DB4
DB5
  Bottom 0.2: U1.7 50.66,21.16 52.06,22.55 LCD1.DB5
DB6
  Bottom 0.2: U1.8 50.8,20.75 51.59,21.55 LCD1.DB6
DB7
  Bottom 0.2: LCD1.DB7 56.33,20.36 U1.9
DM  (via drill 0.2)
  Top 0.406: v37.23,9.68 v37.23,7.7
  Bottom 0.406: R2.1 37.7,9.68 v37.23,9.68 | J2.2 39.65,6.9 38.85,7.7 v37.23,7.7 | v37.23,7.7
DP  (via drill 0.2)
  Top 0.406: v36.59,9.68 36.67,9.6 v36.67,7.46
  Bottom 0.406: R3.1 36.13,9.71 36.57,9.71 v36.59,9.68 | v36.67,7.46 36.99,7.14 38.58,7.14 39,6.72 J2.3
DVDD  (via drill 0.2)
  Top 0.406: v35.16,15 35.16,26.67 v36.51,28.02
  Bottom 0.2: U1.23 38.31,16.72 36.71,15.12 36.03,15.12 | 36.53,26.99 C11.1 | U1.50 39.11,26.09 39.95,26.93 40.34,26.93 C12.1
  Bottom 0.254: 36.03,15.12 C14.1 | U1.45 37.11,25.6 36.53,26.18 36.53,26.99 36.53,28 v36.51,28.02 36.54,28.05 39.22,28.05 39.7,27.57 40.34,27.57 C12.1
  Bottom 0.406: C14.1 35.87,15 v35.16,15
FSYNC  (via drill 0.2)
  Top 0.2: v49.53,19.53 49.53,9.29 v49.45,9.21
  Bottom 0.2: U1.11 43.15,19.55 43.93,18.77 48.01,18.77 R8.1 v49.53,19.53 | v49.45,9.21 49.36,9.12 45.49,9.12 45.35,9.26 44.98,9.26 44.79,9.07 34.69,9.07 R10.2
GN  (via drill 0.2)
  Top 0.2: LED1.3 16.94,19.31 v17.78,19.31
  Bottom 0.2: R19.2 24.13,18.43 23.97,18.27 19.27,18.27 18.23,19.31 v17.78,19.31
GND  (via drill 0.2)
  Bottom 0.2: R22.1 8.63,8.57 v12.86,8.57 | R21.1 8.06,30.96 v12.46,30.96 | R24.1 68.6,9.07 67.87,8.33 67.87,6.88 66.55,5.56 v65.41,5.56 | R23.1 67.06,31.28 66.52,31.83 63.74,31.83 63.21,31.3 60.77,31.3 v60.64,31.43
  other vias: 47.31,19.84 47.31,19.29 47.94,26.27 47.23,23.89 47.31,12.94 44.13,15.88 35.08,13.65 35.08,13.02 37.15,6.19 37.15,5.64 26.19,1.91 28.26,1.91 30.32,1.91 29.61,10 25.56,10.08 25.16,15.24 25.16,14.68 25.24,28.97 59.37,11.59 46.75,5.08 50.88,3.49 53.82,3.49 37.15,30.08 39.61,28.65 39.61,29.29 33.58,28.97 27.23,28.97 29.37,28.97 31.27,28.97 35.4,28.97 39.93,18.26 38.73,22.86 40.96,21.91 40.96,20 36.35,23.18 36.35,21.27 53.82,0.48 22.07,28.18 53.66,11.59 53.66,28.57 59.37,28.57 18.73,26.99 20,26.99 20,29.53 18.73,29.53 23.42,32.62 24.53,32.62 41.75,32.62 43.18,32.62 39.61,15.88 28.5,6.03 30.64,19.76 30.64,19.21 31.11,24.69 31.11,25.24 22.54,23.18 16.83,30.48 19.68,21.91 19.68,20 19.68,15.88 12.38,36.51 65.64,36.2 65.56,0.48 59.85,0.48 47.15,0.48 30.96,0.48 12.54,0.48 12.54,7.14 12.54,14.13 12.54,20.48 33.34,36.51 44.13,36.51 61.91,28.57 61.91,11.59 48.97,6.99 53.1,6.99 51.2,8.89 62.31,3.49 33.73,8.57 30.96,11.67 27.15,18.02 28.42,22.46 24.53,23.18 51.04,15.88 24.53,28.18
  pour Bottom (no thermals): 23.34,36.83 24.61,36.83 24.61,33.02 23.34,33.02
  pour Bottom (no thermals): 41.59,36.83 43.34,36.83 43.34,33.02 41.59,33.02
  pour Bottom (rank 6): 12.06,36.83 66.04,36.83 66.04,31.11 63.5,31.11 63.5,5.71 66.04,5.71 66.04,0 12.06,0
  pour Top (rank 6): 12.06,36.83 63.5,36.83 63.5,0 12.06,0
GPIO27  (via drill 0.2)
  Top 0.406: v30.35,26.43 30.29,26.37 v30.29,22.43
  Bottom 0.2: U1.39 30.37,22.36 v30.29,22.43 28.67,24.05 27.61,24.05 27.3,23.73 RN1.3 | v30.35,26.43 30.32,26.46
  Bottom 0.406: C19.1 30.32,26.46
GPIO28  (via drill 0.2)
  Top 0.2: v28.41,24.53 v28.42,24.53
  Top 0.406: v28.42,26.43 v28.42,24.53
  Bottom 0.2: U1.40 30.66,22.75 28.89,24.53 v28.41,24.53 RN1.2
  Bottom 0.406: C20.1 28.42,27.09 v28.42,26.43
GPIO29
  Bottom 0.2: RN1.1 27.3,25.33 27.61,25.01 28.88,25.01 30.74,23.16 U1.41
  Bottom 0.406: RN1.1 26.82,25.81 26.19,26.43 C21.1
I2C1_SCL  (via drill 0.2)
  Top 0.2: v28.89,11.67 28.89,13.02 30.31,14.44 30.31,18.46 30.34,18.49 v30.34,18.52
  Bottom 0.2: U4.23 29.01,11.55 v28.89,11.67 28.26,12.3 R17.1 | U1.30 35,18.75 34.76,18.52 v30.34,18.52
I2C1_SDA  (via drill 0.2)
  Top 0.2: v29.53,11.67 29.53,13.14 30.64,14.25 30.64,17.91 v30.8,18.07
  Bottom 0.2: U4.24 29.51,11.65 v29.53,11.67 30.32,12.46 R16.1 | U1.29 35.08,18.36 34.84,18.12 30.8,18.12 v30.8,18.07
LCD_DISPLAY  (via drill 0.2)
  Top 0.2: v45.4,11.67 45.48,11.59 45.48,9.13 v45.16,8.81 | v36.12,20.38 36.12,13.32 35.72,12.92 35.72,8.65 v35.56,8.49
  Bottom 0.2: R15.1 45.43,11.64 v45.4,11.67 | v45.16,8.81 45.1,8.75 36.37,8.75 36.12,8.49 v35.56,8.49 | U1.34 35.5,20.38 v36.12,20.38
LED_BL
  Bottom 0.2: R20.1 26.93,21.51 29.05,21.51 29.41,21.16 U1.36
LED_GN
  Bottom 0.2: R19.1 24.13,20.85 25.18,21.91 29.13,21.91 29.48,21.55 U1.37
LED_RD
  Bottom 0.2: U1.35 28.28,20.75
  Bottom 0.254: 28.28,20.75 R18.1
MPU_FSYNC  (via drill 0.2)
  Top 0.2: v27.46,6.03 27.52,5.98 v27.52,3.49 | v31.04,3.49 31.04,3.65 31.51,4.13 31.51,5.35 32.91,6.75 32.91,11.48 v33.02,11.59
  Bottom 0.2: U4.11 27.51,6.08 v27.46,6.03 | v27.52,3.49 v31.04,3.49 | R10.1 33.76,11.59 v33.02,11.59
MPU_INT  (via drill 0.2)
  Top 0.2: v27.78,23.5 27.86,23.42 27.86,14.68 26.67,13.49 26.67,6.11 v26.75,6.03
  Bottom 0.2: U1.38 30.11,21.95 28.5,23.57 27.86,23.57 v27.78,23.5 | U4.12 27.01,6.29 v26.75,6.03
N$1
  Bottom 0.2: C15.1 43.18,13.28 | 43.18,13.28 R1.1 | 43.18,13.28 43.16,13.26 43.16,10.73 42.32,9.89 Q1.1
N$2
  Bottom 0.2: U1.21 39.11,14.51 39.62,13.99 39.62,13.68 C16.1 | Q1.3 39.98,13.24
  Bottom 0.254: 39.98,13.24 C16.1
N$3
  Bottom 0.2: LCD1.RD 50.48,19.55 R8.2
N$4
  Bottom 0.2: U1.20 39.51,16.69 40.42,15.78 41.26,15.78 42.06,14.98
  Bottom 0.254: 42.06,14.98 R1.2
N$27
  Bottom 0.254: R15.2 46.33,10.08 48.03,10.08 T1.1
RED  (via drill 0.2)
  Top 0.2: v17.78,17.46 17.59,17.65 LED1.2
  Bottom 0.2: R18.2 28.26,18.02 27.7,17.46 v17.78,17.46
REGOUT
  Bottom 0.2: U4.10 28.01,5.81 28.26,5.56 C23.1
RS
  Bottom 0.2: U1.13 42.88,18.75 43.62,18.02 52.59,18.02 52.89,17.71 56.37,17.71 LCD1.RS
RST  (via drill 0.2)
  Top 0.2: v28.81,16.61 28.89,16.69 28.89,29.21 26.51,31.59 v26.51,32.94
  Bottom 0.2: U1.26 37.11,17 36.62,16.51 28.91,16.51 v28.81,16.61 | v26.51,32.94 RST.TP
  pour Bottom (no thermals): 25.88,36.83 27.15,36.83 27.15,33.02 25.88,33.02
RST_DISPLAY
  Bottom 0.2: U1.14 42.74,18.36 43.46,17.64 52.36,17.64 53.45,16.55 LCD1.RST
SCK  (via drill 0.2)
  Top 0.2: v41.75,28.26 41.6,28.11 41.6,27.33 40.5,26.23 v40.5,25.88
  Bottom 0.2: U2.6 v41.75,28.26 | v40.5,25.88 39.91,25.28 U1.52
SI
  Bottom 0.2: U1.53 40.31,25.01 42.28,26.99 U2.5
SO  (via drill 0.2)
  Top 0.2: v45.96,26.19 v45.96,29.53
  Bottom 0.2: U1.55 41.1,24.89 42.27,26.05 45.82,26.05 v45.96,26.19 | v45.96,29.53 U2.2
SW_TP1  (via drill 0.2)
  Top 0.2: v22.07,17.01 v22.07,19.84 22.07,21.51 v22.07,21.67
  Bottom 0.2: U1.28 36.09,17.52 35.8,17.22 29.37,17.22 29.15,17.44 28.32,17.44 27.96,17.08 22.14,17.08 v22.07,17.01 | v22.07,19.84 R7.1 | v22.07,21.67 21.91,21.51 21.35,21.51 20.94,21.1 13.27,21.1 8,26.37 R21.2
SW_TP2  (via drill 0.2)
  Top 0.2: v19.05,15 v19.05,7.62
  Bottom 0.2: U1.27 36.69,17.5 36.69,17.04 36.5,16.85 29.21,16.85 29,17.06 28.49,17.06 28.12,16.69 23.04,16.69 22.07,15.72 R9.1 22.06,15 v19.05,15 | R22.2 9.9,7.62 v19.05,7.62
SW_TP3  (via drill 0.2)
  Top 0.2: v40.77,16.46 40.77,15.45 40.32,15 v40.32,7.3 | v55.83,7.34 55.88,7.28 v55.88,5.08 | v60.32,5.87 60.32,6.27 60.79,6.74 60.79,30.67 v60.67,30.8
  Bottom 0.2: v40.32,7.3 40.46,7.44 55.88,7.44 | v40.77,16.46 40.71,16.52 U1.17 | R11.1 v55.88,5.08 | v55.83,7.34 55.83,7.38 55.88,7.44 | v60.32,5.87 60.32,6.05 58.93,7.44 55.88,7.44 | v60.67,30.8 60.73,30.86 63.35,30.86 63.92,31.43 66.36,31.43 68.9,28.89 69.28,28.89 R23.2
SW_TP4  (via drill 0.2)
  Top 0.2: v40.24,16.75 40.24,15.4 39.93,15.08 39.93,7.73 v39.85,7.65 | v57.94,5.08 v57.94,7.93
  Bottom 0.2: v40.24,16.75 40.31,16.81 U1.18 | R13.1 v57.94,5.08 | v39.85,7.65 40.03,7.65 40.17,7.79 57.15,7.79 57.94,7.79 | v57.94,7.93 57.94,7.79 | R24.2 67.68,6.23 66.46,5.01 61.82,5.01 59.05,7.79 57.94,7.79
SWCLK  (via drill 0.2)
  Top 0.2: v23.73,16.22 23.73,26.11 v23.26,26.59
  Bottom 0.2: U1.24 37.91,16.8 36.88,15.77 24.13,15.77 v23.73,16.22 | v23.26,26.59 23.18,26.67 J1.1
SWDIO  (via drill 0.2)
  Top 0.2: v24.37,16.22 24.18,16.41 24.06,16.53 24.06,29.06 v24.21,29.21
  Bottom 0.2: U1.25 37.51,16.87 36.78,16.14 24.42,16.14 v24.37,16.22 | v24.21,29.21 24.18,29.18 J1.3
TE
  Bottom 0.2: U1.16 41.13,17.5 41.13,17.04 41.32,16.85 52.05,16.85 54.35,14.55 LCD1.TE
TP1  (via drill 0.2)
  Top 0.2: TP1.P$1 10.31,22.15 v10.87,22.15
  Bottom 0.2: R7.2 13.07,20.77 11.7,22.15 v10.87,22.15
  pour Top: 11,37 11,22 3.3,22 0,26 0,33.97 6.67,36.99 7.75,37
TP2  (via drill 0.2)
  Top 0.2: TP2.P$1 10.94,8.08 v10.95,8.1 | v18.57,13.34 18.65,13.26 18.65,8.26 v18.57,8.18
  Bottom 0.2: R9.2 21.99,13.37 18.61,13.37 v18.57,13.34 | v18.57,8.18 18.49,8.1 v10.95,8.1
  pour Top: 11,0 11,15 3.3,15 0,11 0,3 6,0
TP3  (via drill 0.2)
  Top 0.2: v61.44,31.75 61.12,31.43 61.12,3.73 v61.12,3.49 | TP3.P$1 67.04,32.25 v67.01,32.23
  Bottom 0.2: v67.01,32.23 63.36,32.23 62.89,31.75 v61.44,31.75 | R11.2 56.72,3.49 v61.12,3.49
  pour Top: 67,37 67,22 74.7,22 78,26 78,34 72.55,36.99 72,36.99 72,37
TP4  (via drill 0.2)
  Top 0.2: TP4.P$1 v67.07,2.54
  Bottom 0.2: v67.07,2.54 59.05,2.54 58.06,2.54 R13.2
  pour Top: 67,0 67,15 74.7,15 78,11 78,3 72,0
UART1-RX/I2C0-SCL/PWM2B  (via drill 0.2)
  Top 0.2: v34.17,19.48 34.41,19.72 34.41,27.06 36.2,28.85 36.2,30.87 35.32,31.75 v35.32,32.86
  Bottom 0.2: U1.32 34.36,19.55 34.28,19.48 v34.17,19.48 | v35.32,32.86 35.08,33.1 SCL.TP
  pour Bottom (no thermals): 34.45,36.83 36.2,36.83 36.2,33.02 34.45,33.02
UART1-TX/I2C0-SDA/PWM2A  (via drill 0.2)
  Top 0.2: v34.55,19.03 34.73,19.21 34.73,26.93 36.61,28.8 36.61,30.89 37.62,31.91 v37.62,32.86
  Bottom 0.2: U1.31 34.67,19.16 v34.55,19.03 | v37.62,32.86 SDA.TP
  pour Bottom (no thermals): 36.99,36.83 38.26,36.83 38.26,33.02 36.99,33.02
USB_N  (via drill 0.2)
  Top 0.406: v37.22,11.67 37.22,11.7 37.6,12.08 37.6,23.46 37.65,23.51 v37.65,23.59
  Bottom 0.254: v37.65,23.59 37.51,23.73 U1.46
  Bottom 0.406: R2.2 37.24,11.64 v37.22,11.67
USB_P  (via drill 0.2)
  Top 0.406: v36.63,11.67 36.63,11.99 37.04,12.4 37.04,24.43 37.72,25.11 v37.72,25.19
  Bottom 0.254: U1.47 37.91,25 v37.72,25.19
  Bottom 0.406: R3.2 36.61,11.64 v36.63,11.67
VDD  (via drill 0.2)
  Top 0.406: v48.1,6.99 v48.1,3.1 | v44.53,6.99 44.53,7.62 44.13,8.02 v44.13,10.72 | v40.8,10.79 40.8,7.62 40.88,7.54 v40.88,6.99 | v31.91,10.79 31.93,10.82 31.93,14.99 31.91,15.01 31.91,31.43 31.59,31.75 v31.59,32.86
  Bottom 0.406: v48.1,6.99 v44.53,6.99 v40.88,6.99 40.8,6.99 40.3,6.49 J2.1 | v48.1,3.1 C13.1 49.72,2.09 U3.3 49.98,1.86 50.47,1.36 51.35,1.36 51.88,1.89 U3.1 | R4.2 44.15,10.7 v44.13,10.72 | v40.8,10.79 v31.91,10.79 | v31.59,32.86 VCC2.TP
  pour Bottom (no thermals): 30.96,36.83 32.23,36.83 32.23,33.02 30.96,33.02
WR
  Bottom 0.2: U1.12 43.02,19.16 43.77,18.39 52.59,18.39 52.74,18.55 LCD1.WR

### Text on the board
tStop: A | B | BOOTSEL | C | D
bStop: GND | 3V3 | VUSB | GND | SWD | github.com/nubix-de/opnic | REV A
Descript: Grove-Connector I2C/UART/PWM / (Verriegelung nach TOP-Seite)